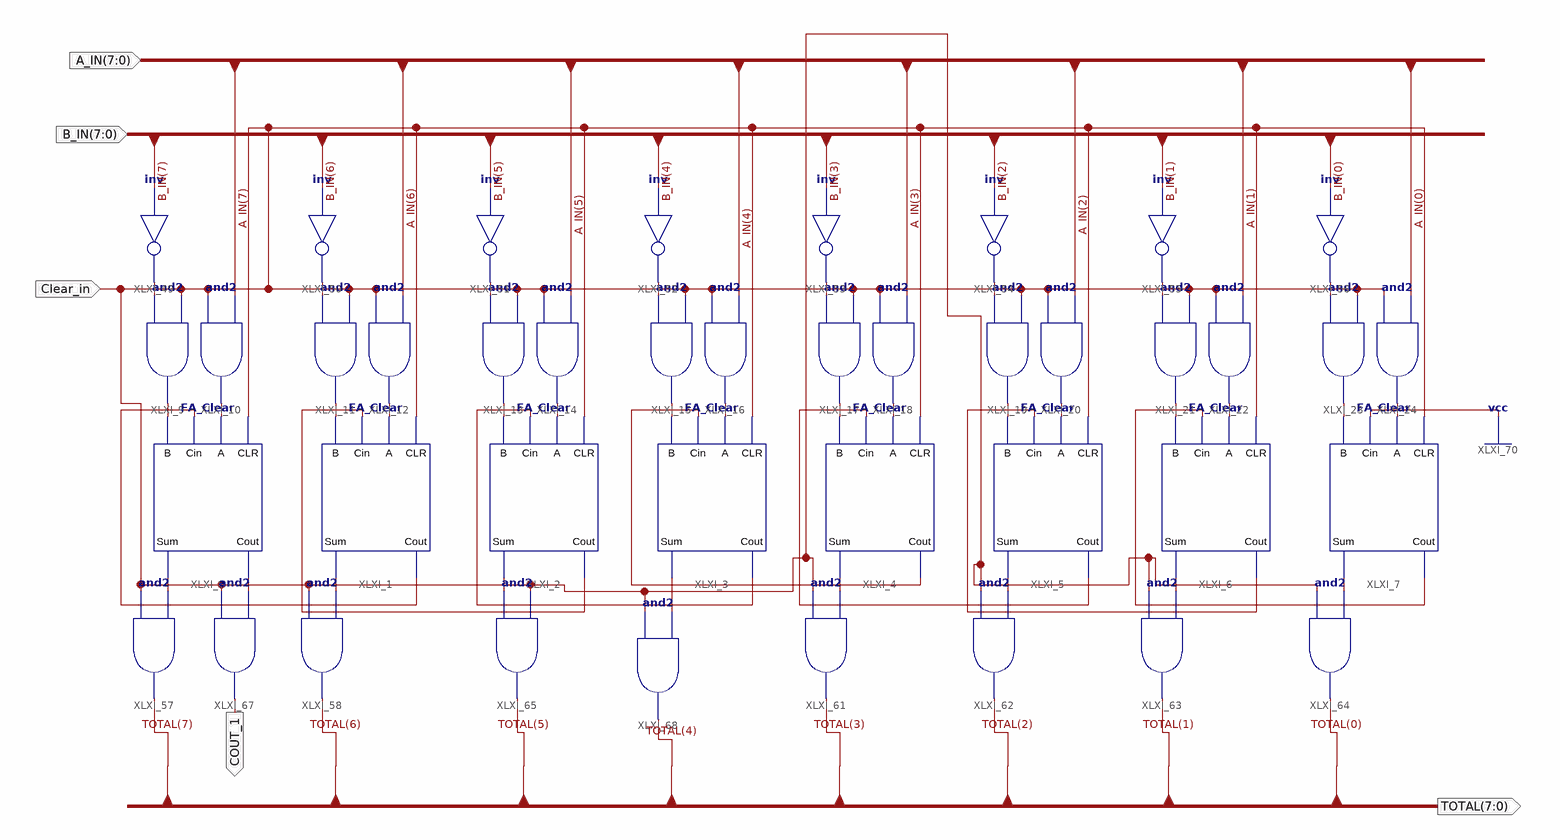
[diagram p0: schematic sheet 1]
// Xilinx ISE schematic ssubtractor_with_BUS.sch (artix7) as structural Verilog: 41 symbols, 5 ports
module ssubtractor_with_BUS (
  input  [7:0] A_IN,
  input  [7:0] B_IN,
  input  Clear_in,
  output [7:0] TOTAL,
  output COUT_1
);

  wire XLXN_3, XLXN_4, XLXN_5, XLXN_6, XLXN_7, XLXN_8, XLXN_9, XLXN_10, XLXN_11, XLXN_12, XLXN_13, XLXN_14,
       XLXN_15, XLXN_16, XLXN_17, XLXN_18, XLXN_49, XLXN_50, XLXN_53, XLXN_54, XLXN_57, XLXN_58, XLXN_61,
       XLXN_63, XLXN_79, XLXN_80, XLXN_81, XLXN_83, XLXN_84, XLXN_85, XLXN_90, XLXN_91, XLXN_94, XLXN_95,
       XLXN_96, XLXN_97, XLXN_98, XLXN_99, XLXN_100, XLXN_101;

  FA_Clear XLXI_2 (.CLR(Clear_in), .A(XLXN_8), .Cin(XLXN_81), .B(XLXN_7), .Cout(XLXN_80), .Sum(XLXN_99));
  FA_Clear XLXI_3 (.CLR(Clear_in), .A(XLXN_10), .Cin(XLXN_98), .B(XLXN_9), .Cout(XLXN_81), .Sum(XLXN_100));
  FA_Clear XLXI_1 (.CLR(Clear_in), .A(XLXN_6), .Cin(XLXN_80), .B(XLXN_5), .Cout(XLXN_79), .Sum(XLXN_91));
  FA_Clear XLXI_4 (.CLR(Clear_in), .A(XLXN_12), .Cin(XLXN_83), .B(XLXN_11), .Cout(XLXN_98), .Sum(XLXN_94));
  FA_Clear XLXI_5 (.CLR(Clear_in), .A(XLXN_14), .Cin(XLXN_84), .B(XLXN_13), .Cout(XLXN_83), .Sum(XLXN_95));
  FA_Clear XLXI_6 (.CLR(Clear_in), .A(XLXN_16), .Cin(XLXN_85), .B(XLXN_15), .Cout(XLXN_84), .Sum(XLXN_96));
  FA_Clear XLXI_7 (.CLR(Clear_in), .A(XLXN_18), .Cin(1'b1), .B(XLXN_17), .Cout(XLXN_85), .Sum(XLXN_97));
  FA_Clear XLXI_8 (.CLR(Clear_in), .A(XLXN_4), .Cin(XLXN_79), .B(XLXN_3), .Cout(XLXN_101), .Sum(XLXN_90));
  and XLXI_9 (XLXN_3, XLXN_61, Clear_in);
  and XLXI_10 (XLXN_4, Clear_in, A_IN[7]);
  and XLXI_11 (XLXN_5, XLXN_63, Clear_in);
  and XLXI_12 (XLXN_6, Clear_in, A_IN[6]);
  and XLXI_13 (XLXN_7, XLXN_58, Clear_in);
  and XLXI_14 (XLXN_8, Clear_in, A_IN[5]);
  and XLXI_15 (XLXN_9, XLXN_57, Clear_in);
  and XLXI_16 (XLXN_10, Clear_in, A_IN[4]);
  and XLXI_17 (XLXN_11, XLXN_54, Clear_in);
  and XLXI_18 (XLXN_12, Clear_in, A_IN[3]);
  and XLXI_19 (XLXN_13, XLXN_53, Clear_in);
  and XLXI_20 (XLXN_14, Clear_in, A_IN[2]);
  and XLXI_21 (XLXN_15, XLXN_50, Clear_in);
  and XLXI_22 (XLXN_16, Clear_in, A_IN[1]);
  and XLXI_23 (XLXN_17, XLXN_49, Clear_in);
  and XLXI_24 (XLXN_18, Clear_in, A_IN[0]);
  not XLXI_49 (XLXN_61, B_IN[7]);
  not XLXI_50 (XLXN_63, B_IN[6]);
  not XLXI_51 (XLXN_58, B_IN[5]);
  not XLXI_52 (XLXN_57, B_IN[4]);
  not XLXI_54 (XLXN_53, B_IN[2]);
  not XLXI_55 (XLXN_50, B_IN[1]);
  not XLXI_56 (XLXN_49, B_IN[0]);
  and XLXI_57 (TOTAL[7], Clear_in, XLXN_90);
  and XLXI_58 (TOTAL[6], Clear_in, XLXN_91);
  and XLXI_61 (TOTAL[3], Clear_in, XLXN_94);
  and XLXI_62 (TOTAL[2], Clear_in, XLXN_95);
  and XLXI_63 (TOTAL[1], Clear_in, XLXN_96);
  and XLXI_64 (TOTAL[0], Clear_in, XLXN_97);
  and XLXI_65 (TOTAL[5], XLXN_99, Clear_in);
  and XLXI_67 (COUT_1, Clear_in, XLXN_101);
  and XLXI_68 (TOTAL[4], Clear_in, XLXN_100);
  not XLXI_53 (XLXN_54, B_IN[3]);
endmodule
